# Altium schematic sheet PowerBridge.SchDoc
size A4; DocumentNumber: 1; SheetNumber: 2; SheetTotal: 14
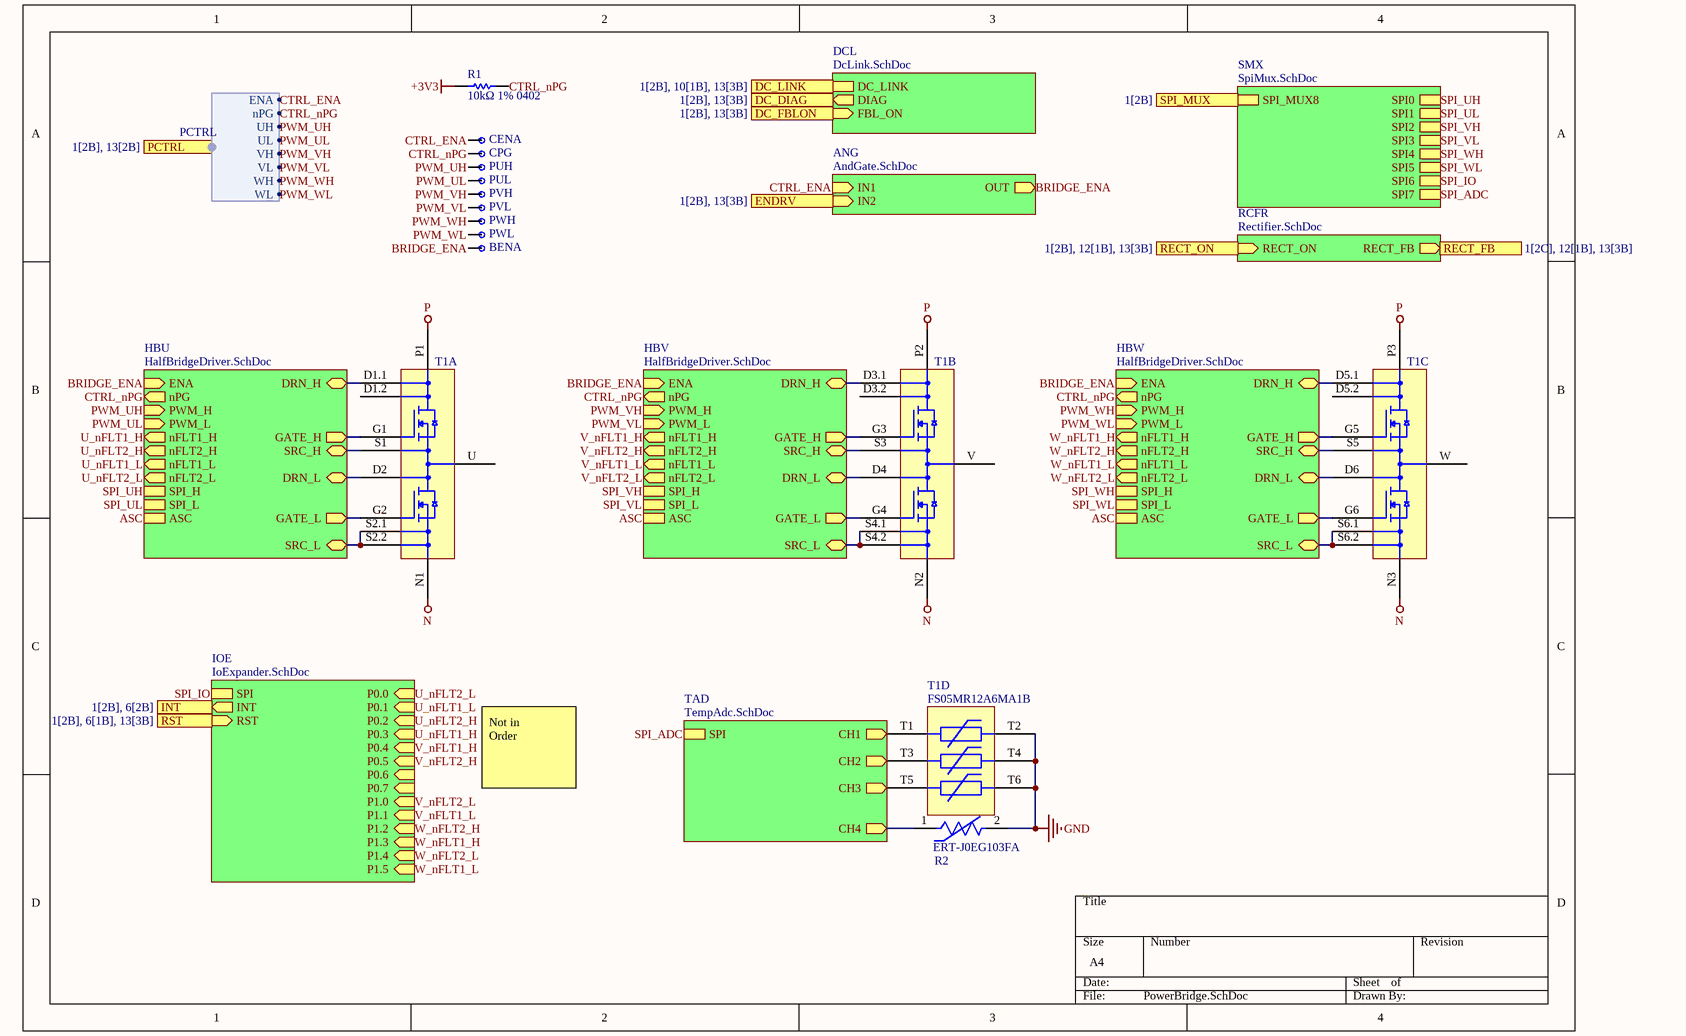
[diagram p0: PowerBridge.SchDoc]

## Parts
BENA  Testpoint  [Testpoint-Footprint-1]  (value not drawn)  (no BOM)
CENA  Testpoint  [Testpoint-Footprint-1]  (value not drawn)  (no BOM)
CPG  Testpoint  [Testpoint-Footprint-1]  (value not drawn)  (no BOM)
PUH  Testpoint  [Testpoint-Footprint-1]  (value not drawn)  (no BOM)
PUL  Testpoint  [Testpoint-Footprint-1]  (value not drawn)  (no BOM)
PVH  Testpoint  [Testpoint-Footprint-1]  (value not drawn)  (no BOM)
PVL  Testpoint  [Testpoint-Footprint-1]  (value not drawn)  (no BOM)
PWH  Testpoint  [Testpoint-Footprint-1]  (value not drawn)  (no BOM)
PWL  Testpoint  [Testpoint-Footprint-1]  (value not drawn)  (no BOM)
R1  10kΩ 1% 0402  [0402N]
R2  ERT-J0EG103FA  [FP-ERTJ0-MFG]
T1  FS05MR12A6MA1B  [FS05MR12A6MA1B-Footprint-1]  (value not drawn)  (parts A,B,C,D of 4)

## Sub-sheets
ANG = AndGate.SchDoc: IN1 (in), IN2 (in), OUT (out)
DCL = DcLink.SchDoc: DC_LINK (harness DC_LINK), DIAG (out), FBL_ON (in)
HBU = HalfBridgeDriver.SchDoc: PWM_H (in), PWM_L (in), SRC_H (bidir), SRC_L (bidir), DRN_H (bidir), GATE_H (out), GATE_L (out), nFLT1_H (out), nFLT2_H (out), nFLT1_L (out), nFLT2_L (out), SPI_H (harness SPI), SPI_L (harness SPI), ASC (harness ASC), ENA (in), nPG (out), DRN_L (bidir)
HBV = HalfBridgeDriver.SchDoc: PWM_H (in), PWM_L (in), GATE_H (out), GATE_L (out), nFLT1_H (out), nFLT2_H (out), nFLT1_L (out), nFLT2_L (out), SPI_H (harness SPI), SPI_L (harness SPI), ASC (harness ASC), ENA (in), nPG (out), SRC_H (bidir), SRC_L (bidir), DRN_H (bidir), DRN_L (bidir)
HBW = HalfBridgeDriver.SchDoc: PWM_H (in), PWM_L (in), GATE_H (out), GATE_L (out), nFLT1_H (out), nFLT2_H (out), nFLT1_L (out), nFLT2_L (out), SPI_H (harness SPI), SPI_L (harness SPI), ASC (harness ASC), ENA (in), nPG (out), SRC_H (bidir), SRC_L (bidir), DRN_H (bidir), DRN_L (bidir)
IOE = IoExpander.SchDoc: P0.0 (in), P0.1 (in), P0.2 (in), P0.3 (in), P0.4 (in), P0.5 (in), P0.6 (in), P0.7 (in), P1.0 (in), P1.1 (in), P1.2 (in), P1.3 (in), P1.4 (in), P1.5 (in), INT (out), SPI (harness SPI), RST (in)
RCFR = Rectifier.SchDoc: RECT_ON (in), RECT_FB (out)
SMX = SpiMux.SchDoc: SPI_MUX8 (harness SPI_MUX8), SPI0 (harness SPI), SPI1 (harness SPI), SPI2 (harness SPI), SPI3 (harness SPI), SPI4 (harness SPI), SPI5 (harness SPI), SPI6 (harness SPI), SPI7 (harness SPI)
TAD = TempAdc.SchDoc: CH1 (out), CH2 (out), CH3 (out), CH4 (out), SPI (harness SPI)

## Ports
DC_DIAG (out, see 1[2B], 13[3B]), DC_FBLON (in, see 1[2B], 13[3B]), DC_LINK (harness DC_LINK, see 1[2B], 10[1B], 13[3B]), ENDRV (in, see 1[2B], 13[3B]), INT (out, see 1[2B], 6[2B]), PCTRL (harness PCTRL, see 1[2B], 13[2B]), RECT_FB (out, see 1[2C], 12[1B], 13[3B]), RECT_ON (in, see 1[2B], 12[1B], 13[3B]), RST (in, see 1[2B], 6[1B], 13[3B]), SPI_MUX (harness SPI_MUX8, see 1[2B])

## Harnesses
PCTRL: UH, UL, VH, VL, WH, WL, ENA, nPG

## Nets
+3V3: R1.1
GND: R2.2 T1.T2(PIN) T1.T4(PIN) T1.T6(PIN)
N: T1.N1(PIN) T1.N2(PIN) T1.N3(PIN)
P: T1.P1(PIN) T1.P2(PIN) T1.P3(PIN)
BRIDGE_ENA: BENA.1 ; sheet HBU/ENA, sheet HBW/ENA, sheet ANG/OUT, sheet HBV/ENA
CTRL_ENA: CENA.1 ; sheet ANG/IN1, port PCTRL.ENA
CTRL_nPG: CPG.1 R1.2 ; sheet HBU/nPG, sheet HBW/nPG, sheet HBV/nPG, port PCTRL.nPG
DC_DIAG: port DC_DIAG, sheet DCL/DIAG
DC_FBLON: port DC_FBLON, sheet DCL/FBL_ON
ENDRV: port ENDRV, sheet ANG/IN2
INT: port INT, sheet IOE/INT
PWM_UH: PUH.1 ; sheet HBU/PWM_H, port PCTRL.UH
PWM_UL: PUL.1 ; sheet HBU/PWM_L, port PCTRL.UL
PWM_VH: PVH.1 ; sheet HBV/PWM_H, port PCTRL.VH
PWM_VL: PVL.1 ; sheet HBV/PWM_L, port PCTRL.VL
PWM_WH: PWH.1 ; sheet HBW/PWM_H, port PCTRL.WH
PWM_WL: PWL.1 ; sheet HBW/PWM_L, port PCTRL.WL
RECT_FB: port RECT_FB, sheet RCFR/RECT_FB
RECT_ON: port RECT_ON, sheet RCFR/RECT_ON
RST: port RST, sheet IOE/RST
U_nFLT1_H: sheet HBU/nFLT1_H, sheet IOE/P0.3
U_nFLT1_L: sheet HBU/nFLT1_L, sheet IOE/P0.1
U_nFLT2_H: sheet HBU/nFLT2_H, sheet IOE/P0.2
U_nFLT2_L: sheet HBU/nFLT2_L, sheet IOE/P0.0
V_nFLT1_H: sheet IOE/P0.4, sheet HBV/nFLT1_H
V_nFLT1_L: sheet IOE/P1.1, sheet HBV/nFLT1_L
V_nFLT2_H: sheet IOE/P0.5, sheet HBV/nFLT2_H
V_nFLT2_L: sheet IOE/P1.0, sheet HBV/nFLT2_L
W_nFLT1_H: sheet HBW/nFLT1_H, sheet IOE/P1.3
W_nFLT1_L: sheet HBW/nFLT1_L, sheet IOE/P1.5
W_nFLT2_H: sheet HBW/nFLT2_H, sheet IOE/P1.2
W_nFLT2_L: sheet HBW/nFLT2_L, sheet IOE/P1.4
NetR2_1: R2.1 ; sheet TAD/CH4
NetT1_D1.1: T1.D1.1(PIN) ; sheet HBU/DRN_H
NetT1_D2: T1.D2(PIN) ; sheet HBU/DRN_L
NetT1_D3.1: T1.D3.1(PIN) ; sheet HBV/DRN_H
NetT1_D4: T1.D4(PIN) ; sheet HBV/DRN_L
NetT1_D5.1: T1.D5.1(PIN) ; sheet HBW/DRN_H
NetT1_D6: T1.D6(PIN) ; sheet HBW/DRN_L
NetT1_G1: T1.G1(PIN) ; sheet HBU/GATE_H
NetT1_G2: T1.G2(PIN) ; sheet HBU/GATE_L
NetT1_G3: T1.G3(PIN) ; sheet HBV/GATE_H
NetT1_G4: T1.G4(PIN) ; sheet HBV/GATE_L
NetT1_G5: T1.G5(PIN) ; sheet HBW/GATE_H
NetT1_G6: T1.G6(PIN) ; sheet HBW/GATE_L
NetT1_S1: T1.S1(PIN) ; sheet HBU/SRC_H
NetT1_S2.1: T1.S2.1(PIN) T1.S2.2(PIN) ; sheet HBU/SRC_L
NetT1_S3: T1.S3(PIN) ; sheet HBV/SRC_H
NetT1_S4.1: T1.S4.1(PIN) T1.S4.2(PIN) ; sheet HBV/SRC_L
NetT1_S5: T1.S5(PIN) ; sheet HBW/SRC_H
NetT1_S6.1: T1.S6.1(PIN) T1.S6.2(PIN) ; sheet HBW/SRC_L
NetT1_T1: T1.T1(PIN) ; sheet TAD/CH1
NetT1_T3: T1.T3(PIN) ; sheet TAD/CH2
NetT1_T5: T1.T5(PIN) ; sheet TAD/CH3

Not connected (* = marked no-connect by the designer): T1 D1.2(PIN) D3.2(PIN) D5.2(PIN) U(PIN) V(PIN) W(PIN)

## Buses and harness runs
harness port DC_LINK = sheet DCL/DC_LINK
harness port SPI_MUX = sheet SMX/SPI_MUX8

## Notes on the sheet
- Not in
  Order
- Labels drawn without touching a wire or pin: ASC, SPI_ADC, SPI_IO, SPI_UH, SPI_UL, SPI_VH, SPI_VL, SPI_WH, SPI_WL

## Library data of the parts
BENA CENA CPG PUH PUL PVH PVL PWH PWL = CMP-003-000002-1
R1 = R0402: Resistance: 10k; Tolerance: 1; Footprint: 0402
R2 = CMP-2002-01179-2: THERMISTOR NTC 10KOHM 3380K 0402; Power Rating: 66mW; Accuracy: 1%; Resistance: 10kR; Mount: Surface Mount; Radiation Hardening: No; Case Code (Metric): 1005; Termination: SMD/SMT; Width: 500um; Packaging: Tape and Reel; Case Code (Imperial): 0402; Depth: 0.5mm; Max Operating Temperature: 125°C; REACH SVHC: No SVHC; Case/Package: 0402; RoHS Compliant: Yes; Lead Free: Lead Free; Package Quantity: 1; Min Operating Temperature: -40°C; Tolerance: 1%; Resistance Tolerance: 1%; Height: 0.5mm; Contact Plating: Tin; Series: ERT-J; Max Power Dissipation: 66mW; Number of Pins: 2; Length: 1mm
T1 = CMP-013-00039-2: HybridPACK™ Drive module with CoolSiC™ Automotive MOSFET